# Altium schematic sheet STM32F042G6.SchDoc: STM32F042G6 Schematics
size A3; Revision: 2; SheetNumber: 3; SheetTotal: 4; Version: 1
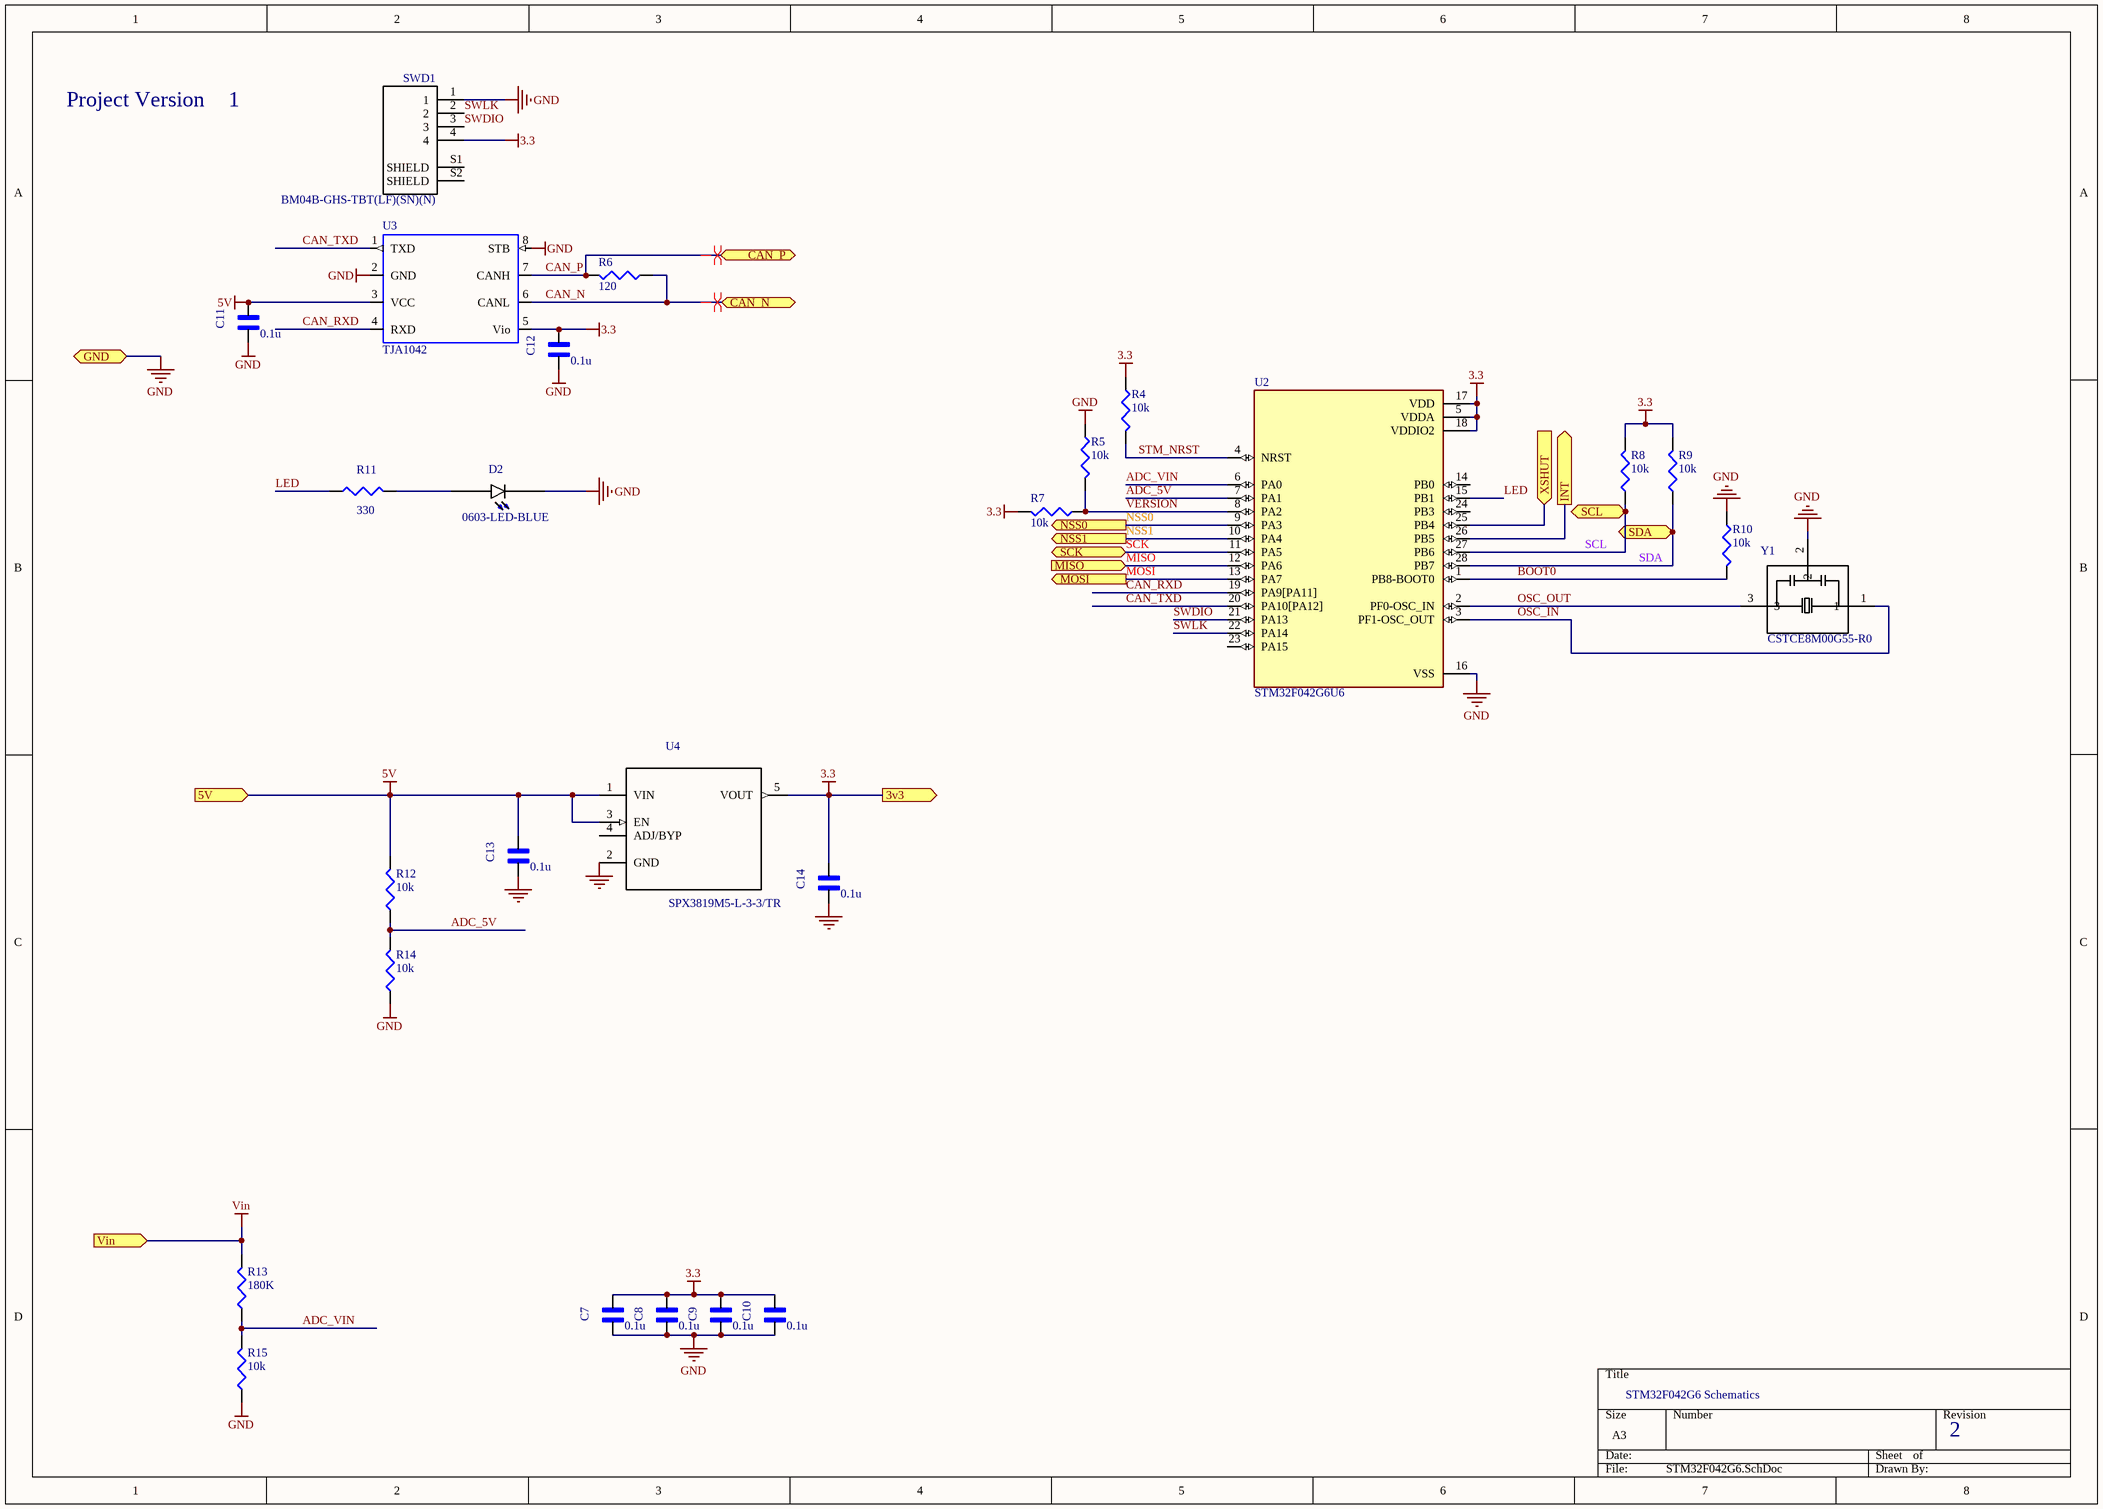
[diagram p0: STM32F042G6.SchDoc]

## Parts
C7  value 0.1u  [*CAPC1608X90]  (hidden comment: GX035C104MAT2-500)
C8  value 0.1u  [*CAPC1608X90]  (hidden comment: GX035C104MAT2-500)
C9  value 0.1u  [*CAPC1608X90]  (hidden comment: GX035C104MAT2-500)
C10  value 0.1u  [*CAPC1608X90]  (hidden comment: GX035C104MAT2-500)
C11  value 0.1u  [*CAPC1608X90]  (hidden comment: GX035C104MAT2-500)
C12  value 0.1u  [*CAPC1608X90]  (hidden comment: GX035C104MAT2-500)
C13  value 0.1u  [*CAPC1608X90]  (hidden comment: GX035C104MAT2-500)
C14  value 0.1u  [*CAPC1608X90]  (hidden comment: GX035C104MAT2-500)
D2  0603-LED-BLUE  [*LEDM1608X80_LTE-C1906R-14(Primary)]
R4  value 10k  [J1-0603]  (hidden comment: RC0603FR-0710KL)
R5  value 10k  [J1-0603]  (hidden comment: RC0603FR-0710KL)
R6  value 120  [J1-0603]  (hidden comment: Res3)
R7  value 10k  [J1-0603]  (hidden comment: RC0603FR-0710KL)
R8  value 10k  [J1-0603]  (hidden comment: RC0603FR-0710KL)
R9  value 10k  [J1-0603]  (hidden comment: RC0603FR-0710KL)
R10  value 10k  [J1-0603]  (hidden comment: RC0603FR-0710KL)
R11  value 330  [J1-0603]  (hidden comment: Res3)
R12  value 10k  [J1-0603]  (hidden comment: RC0603FR-0710KL)
R13  value 180K  [J1-0603]  (hidden comment: RC0603FR-0710KL)
R14  value 10k  [J1-0603]  (hidden comment: RC0603FR-0710KL)
R15  value 10k  [J1-0603]  (hidden comment: RC0603FR-0710KL)
SWD1  BM04B-GHS-TBT(LF)(SN)(N)  [JST_PAD]
U2  STM32F042G6U6  [STM32F042G6U6_UFQFPN4x4]
U3  TJA1042  [SOT782-1]
U4  SPX3819M5-L-3-3/TR  [*SOT95P280X145-5N]
Y1  CSTCE8M00G55-R0  [*OSC_CSTCE8M00G55-R0]

## Ports
3v3 (out), 5V (in), CAN_N (bidir), CAN_P (bidir), GND (bidir), INT (out), MISO (in), MOSI (out), NSS0 (out), NSS1 (out), SCK (bidir), SCL (bidir), SDA (bidir), Vin (in), XSHUT (in)

## Nets
3.3: C7.1 C8.1 C9.1 C10.1 C12.1 C14.1 R4.1 R7.2 R8.2 R9.2 SWD1.4 U2.5(VDDA) U2.17(VDD) U2.18(VDDIO2) U3.5(Vio) U4.5(VOUT) ; port 3v3
5V: C11.1 C13.1 R12.2 U3.3(VCC) U4.1(VIN) U4.3(EN) ; port 5V
GND: C7.2 C8.2 C9.2 C10.2 C11.2 C12.2 C13.2 C14.2 D2.C R5.1 R10.1 R14.1 R15.1 SWD1.1 U2.16(VSS) U3.2(GND) U3.8(STB) U4.2(GND) Y1.2 ; port GND
Vin: R13.2 ; port Vin
ADC_5V: R12.1 R14.2 U2.7(PA1)
ADC_VIN: R13.1 R15.2 U2.6(PA0)
BOOT0: R10.2 U2.1(PB8-BOOT0)
CAN_N: R6.1 U3.6(CANL) ; port CAN_N
CAN_P: R6.2 U3.7(CANH) ; port CAN_P
CAN_RXD: U2.19(PA9[PA11]) U3.4(RXD)
CAN_TXD: U2.20(PA10[PA12]) U3.1(TXD)
INT: U2.26(PB5) ; port INT
LED: R11.1 U2.15(PB1)
MISO: U2.12(PA6) ; port MISO
MOSI: U2.13(PA7) ; port MOSI
NSS0: U2.9(PA3) ; port NSS0
NSS1: U2.10(PA4) ; port NSS1
OSC_IN: U2.3(PF1-OSC_OUT) Y1.1
OSC_OUT: U2.2(PF0-OSC_IN) Y1.3
SCK: U2.11(PA5) ; port SCK
SCL: R8.1 U2.27(PB6) ; port SCL
SDA: R9.1 U2.28(PB7) ; port SDA
STM_NRST: R4.2 U2.4(NRST)
SWDIO: SWD1.3 U2.21(PA13)
SWLK: SWD1.2 U2.22(PA14)
VERSION: R5.2 R7.1 U2.8(PA2)
XSHUT: U2.25(PB4) ; port XSHUT
NetD2_A: D2.A R11.2

Not connected (* = marked no-connect by the designer): SWD1 S1(SHIELD) S2(SHIELD); U2 14(PB0) 23(PA15) 24(PB3); U4 4(ADJ/BYP)

## Layout directives
differential pair: CAN_N, CAN_P

## Notes on the sheet
- Project Version

## Library data of the parts
C7-C12 = GX035C104MAT2-500: Cap Thin Film 0.1uf 50v 0603; MF: AVX; MP: GX035C104MAT2-500 or CL10B104JB8NNNC; Pacage Metric: 1608; Type: SMD; Package: 0603 AVX; SnapEDA_Link: https://www.snapeda.com/parts/GX035C104MAT2-500/AVX/view-part/?ref=snap
C13 C14 = GX035C104MAT2-500: Cap Thin Film 0.1uf 50v 0603; MF: AVX; Pacage Metric: 1608; Type: SMD; Package: 0603 AVX; MP: GX035C104MAT2-500; SnapEDA_Link: https://www.snapeda.com/parts/GX035C104MAT2-500/AVX/view-part/?ref=snap
D2 = LTE-C1906R-14: LED IrLED Chip LED 2-Pin SMD T/R; Package: 0603 Lite-On; MP: 0603-LED-BLUE; SnapEDA_Link: https://www.snapeda.com/parts/LTE-C1906R-14/Lite-On%20Inc./view-part/?ref=snap; Value: *; Type: SMD
R4 R5 R7-R10 R12-R15 = RC0603FR-0710KL: 10 kOhms 1 0.1 W 1 10 W Chip Resistor 0603 1608 Metric Thick Film; Pacage Metric: 1608; MF: Yageo or NXP; MP: 10K 1% 0603; ChipDip_Link: https://www.chipdip.ru/product0/9000079736; HelpURL: https://www.chipdip.ru/product0/9000079736; Package: R0603; Type: SMD; SnapEDA_Link: https://www.snapeda.com/parts/RC0603FR-0710KL/Yageo/view-part/?ref=dk&t=RC0603FR-0710KL&con_ref=None
R6 = Res3: 120 Ohms 1 0.1 W 1 10 W Chip Resistor 0603 1608 Metric Thick Film; Pacage Metric: 1608; MP: RC0603FR-07120RL; ChipDip_Link: https://www.chipdip.ru/product0/9000079618; HelpURL: https://www.chipdip.ru/product0/9000079618; Package: R0603; Type: SMD
R11 = Res3: Resistor; Pacage Metric: 1608; MP: RC0603FR-07330RL; ChipDip_Link: https://www.chipdip.ru/product0/9000079628; HelpURL: https://www.chipdip.ru/product0/9000079628; Package: R0603; Type: SMD
SWD1 = BM04B-GHS-TBT(LF)(SN)(N): Conn Shrouded Header HDR 4 POS 1.25mm Solder ST SMD Reel; MF: JST Sales; MP: SM04B-GHS-TB(LF)(SN); Instructions: Do not install; System: Connector; SnapEDA_Link: https://www.snapeda.com/parts/BM04B-GHS-TBT%28LF%29%28SN%29%28N%29/JST%20Sales%20America%20Inc./view-part/?ref=snap; Package: None; Value: *; Type: SMD
U2 = STM32F042G6U6: ARMÂ® CortexÂ®-M0 STM32F0 Microcontroller IC 32-Bit 48MHz 32KB _32K x 8_ FLASH 28-UFQFPN _4x4_; MF: STMicroelectronics; designer: Ehsan Shaghaei; Package: UFQFN-28 STMicroelectronics; Availability: Unavailable; SnapEDA_Link: https://www.snapeda.com/parts/STM32F042G6U6/STMicroelectronics/view-part/225452/?ref=snap; MP: STM32F042G6U6; Price: None; Value: *; datasheet: https://static.chipdip.ru/lib/914/DOC005914773.pdf; chipdip_link: https://www.chipdip.ru/product/stm32f042g6u6
U3 = TJA1042: 1/1 Transceiver Half CANbus 8-SO; MF: NXP USA; SnapEDA_Link: https://www.snapeda.com/parts/TJA1042/NXP%20USA%20Inc./view-part/900919/?ref=snap; Value: *; MP: TJA1042; Package: VDFN-8 NXP USA; ChipDip_Link: https://www.chipdip.ru/product1/8002840332; HelpURL: https://static.chipdip.ru/lib/583/DOC001583059.pdf; Type: SMD
U4 = SPX3819M5-L: Low Dropout Voltage Regulator, Adjustable 0.5A, В±1%, 2.5 to 16 Vin, 5-Pin SOT-23; MF: MaxLinear, Inc.; Value: 3V3; MP: SPX3819M5-L-3-3/TR; Package: SOT-23-5 Exar; SnapEDA_Link: https://www.snapeda.com/parts/SPX3819M5-L/MaxLinear%2C%20Inc./view-part/?ref=snap; Type: SMD; ChipDip_Link: https://www.chipdip.ru/product1/8003455237; HelpURL: http://www.farnell.com/datasheets/2614478.pdf
Y1 = CSTCE8M00G55-R0: Ceramic Resonator 8MHz ??0.5% _Tol_ ??0.2% _Stability_ 33pF 40Ohm 3-Pin CSMD T/R; MF: Murata; MP: CSTCE8M00G55-R0; Package: SMD-3 Murata; SnapEDA_Link: https://www.snapeda.com/parts/CSTCE8M00G55-R0/Murata%20Electronics%20North%20America/view-part/?ref=snap; Value: *; ChipDip_Link: https://www.chipdip.ru/product1/8001783721; HelpURL: https://www.murata.com/en-eu/api/pdfdownloadapi?cate=&partno=CSTCE8M00G55-R0; Type: SMD